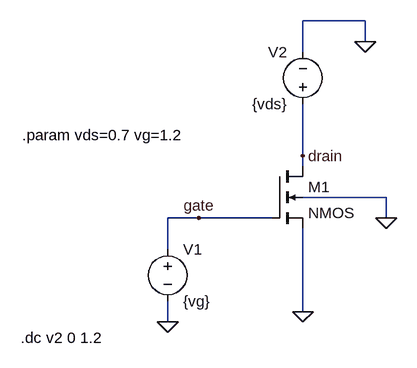
[diagram p0: schematic mos_test.asc]
mos_test.asc, the LTspice schematic file:
Version 4
SHEET 1 880 680
WIRE 528 -32 432 -32
WIRE 528 0 528 -32
WIRE 432 16 432 -32
WIRE 432 176 432 96
WIRE 432 192 432 176
WIRE 560 240 432 240
WIRE 272 272 224 272
WIRE 384 272 272 272
WIRE 560 272 560 240
WIRE 224 320 224 272
WIRE 432 416 432 288
WIRE 224 432 224 400
FLAG 528 0 0
FLAG 560 272 0
FLAG 432 416 0
FLAG 224 432 0
FLAG 272 272 gate
FLAG 432 176 drain
SYMBOL nmos4 384 192 R0
SYMATTR InstName M1
SYMATTR Value2 l=2u w=1u
SYMBOL voltage 224 304 R0
WINDOW 123 0 0 Left 0
WINDOW 39 0 0 Left 0
SYMATTR InstName V1
SYMATTR Value {vg}
SYMBOL voltage 432 112 R180
WINDOW 0 24 96 Left 2
WINDOW 3 24 16 Left 2
WINDOW 123 0 0 Left 0
WINDOW 39 0 0 Left 0
SYMATTR InstName V2
SYMATTR Value {vds}
TEXT 0 144 Left 2 !.param vds=0.7 vg=1.2
TEXT -2 456 Left 2 !.dc v2 0 1.2

The netlist it stands for:
* mos_test.asc
M1 drain gate 0 0 NMOS l=2u w=1u
V1 gate 0 {vg}
V2 drain 0 {vds}
.model NMOS NMOS
.model PMOS PMOS
.lib standard.mos
.param vds=0.7 vg=1.2
.dc v2 0 1.2
.backanno
.end